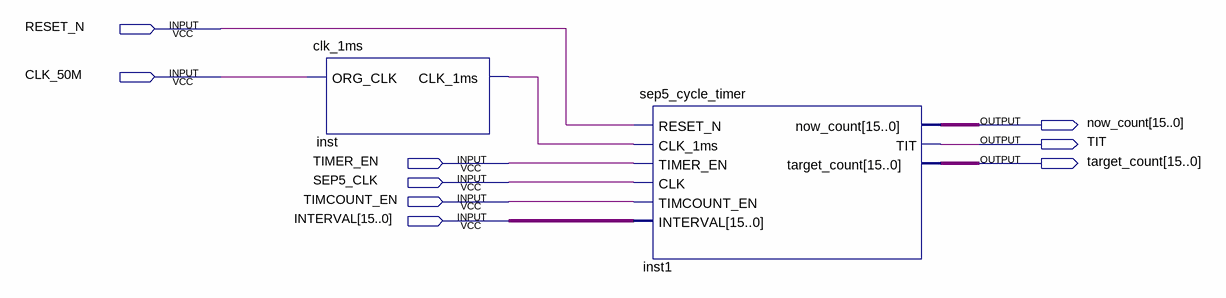
[diagram p0: schematic sheet]
// Quartus schematic sep5_interrupt_timer.bdf as structural Verilog: 2 symbols, 9 pins
module sep5_interrupt_timer (
  input  RESET_N,
  input  CLK_50M,
  input  TIMER_EN,
  input  SEP5_CLK,
  input  TIMCOUNT_EN,
  input  [15:0] INTERVAL,
  output [15:0] now_count,
  output TIT,
  output [15:0] target_count
);

  wire inst_clk_1ms;

  clk_1ms inst (.ORG_CLK(CLK_50M), .CLK_1ms(inst_clk_1ms));
  sep5_cycle_timer inst1 (
    .RESET_N(RESET_N), .CLK_1ms(inst_clk_1ms), .TIMER_EN(TIMER_EN), .CLK(SEP5_CLK),
    .TIMCOUNT_EN(TIMCOUNT_EN), .INTERVAL(INTERVAL), .now_count(now_count), .TIT(TIT),
    .target_count(target_count));
endmodule
